# EAGLE schematic first_PDB (EAGLE 7.2.0)
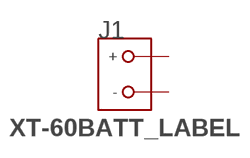
[diagram p0: schematic, sheet 1]

## Parts
J1  XT-60BATT_LABEL  [XT-60]
Unconnected: J1.BATT(+) J1.GND(-)

## Library data of the parts
J1 = RoboJackets-Connectors:XT-60: XT-60 Power Connector Distributor: HobbyKing <http://www.hobbyking.com/hobbyking/store/RC_PRODUCT_SEARCH.asp?strSearch=xt-60>